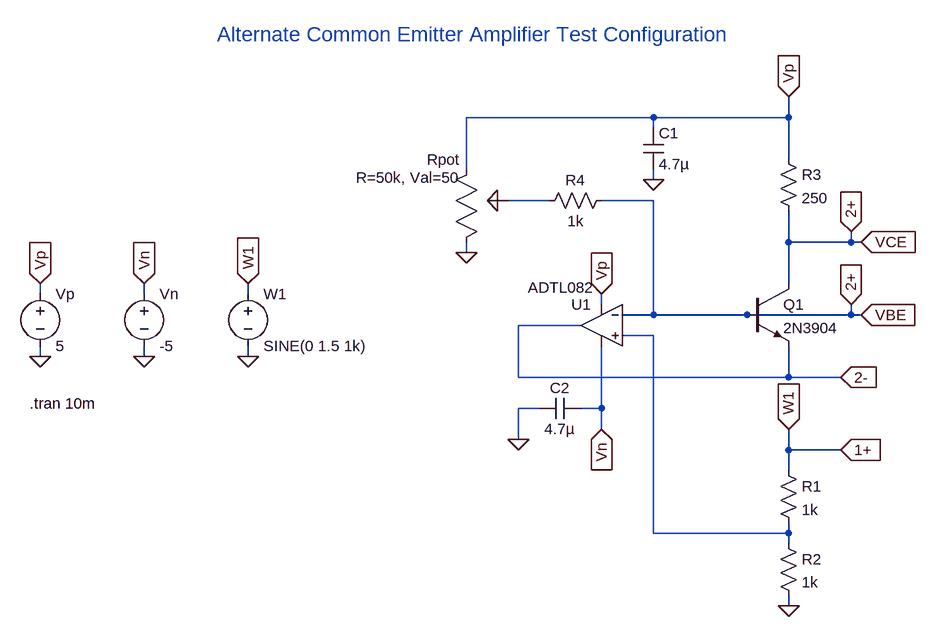
[diagram p0: schematic alt_ce_amp_test_config.asc]
alt_ce_amp_test_config.asc, the LTspice schematic file:
Version 4
SHEET 1 880 744
WIRE 240 -48 -48 -48
WIRE 448 -48 448 -80
WIRE 448 -48 240 -48
WIRE 240 -32 240 -48
WIRE 448 16 448 -48
WIRE -48 32 -48 -48
WIRE 240 48 240 32
WIRE 80 80 16 80
WIRE 240 80 160 80
WIRE 448 144 448 96
WIRE 544 144 544 128
WIRE 544 144 448 144
WIRE 560 144 544 144
WIRE -48 160 -48 144
WIRE 448 208 448 144
WIRE -704 224 -704 208
WIRE -544 224 -544 208
WIRE -384 224 -384 208
WIRE 160 240 160 224
WIRE 240 256 240 80
WIRE 240 256 192 256
WIRE 384 256 240 256
WIRE 544 256 544 240
WIRE 544 256 384 256
WIRE 560 256 544 256
WIRE 128 272 32 272
WIRE 240 288 192 288
WIRE -704 320 -704 304
WIRE -544 320 -544 304
WIRE -384 320 -384 304
WIRE 32 352 32 272
WIRE 448 352 448 304
WIRE 448 352 32 352
WIRE 528 352 448 352
WIRE 64 400 32 400
WIRE 160 400 160 304
WIRE 160 400 128 400
WIRE 160 432 160 400
WIRE 32 448 32 400
WIRE 448 464 448 432
WIRE 528 464 448 464
WIRE 448 496 448 464
WIRE 240 592 240 288
WIRE 448 592 448 576
WIRE 448 592 240 592
WIRE 448 608 448 592
WIRE 448 704 448 688
FLAG 160 224 Vp
IOPIN 160 224 In
FLAG 160 432 Vn
IOPIN 160 432 In
FLAG -48 160 0
FLAG 32 448 0
FLAG 448 704 0
FLAG 448 -80 Vp
IOPIN 448 -80 In
FLAG 240 48 0
FLAG 448 432 W1
IOPIN 448 432 In
FLAG 544 128 2+
IOPIN 544 128 In
FLAG 544 240 2+
IOPIN 544 240 In
FLAG 528 352 2-
IOPIN 528 352 In
FLAG 528 464 1+
IOPIN 528 464 In
FLAG 560 144 VCE
IOPIN 560 144 In
FLAG 560 256 VBE
IOPIN 560 256 In
FLAG -704 320 0
FLAG -544 320 0
FLAG -384 320 0
FLAG -704 208 Vp
IOPIN -704 208 In
FLAG -544 208 Vn
IOPIN -544 208 In
FLAG -384 208 W1
IOPIN -384 208 In
SYMBOL Opamps\\ADTL082 160 208 M0
WINDOW 3 11 6 Left 2
SYMATTR InstName U1
SYMBOL npn 384 208 R0
SYMATTR InstName Q1
SYMATTR Value 2N3904
SYMBOL res 432 480 R0
SYMATTR InstName R1
SYMATTR Value 1k
SYMBOL res 432 592 R0
SYMATTR InstName R2
SYMATTR Value 1k
SYMBOL res 432 0 R0
SYMATTR InstName R3
SYMATTR Value 250
SYMBOL res 176 64 R90
WINDOW 0 0 56 VBottom 2
WINDOW 3 32 56 VTop 2
SYMATTR InstName R4
SYMATTR Value 1k
SYMBOL cap 224 -32 R0
SYMATTR InstName C1
SYMATTR Value 4.7µ
SYMBOL potentiometer -32 48 M0
WINDOW 0 26 -31 Left 2
WINDOW 39 26 -3 Left 2
SYMATTR InstName Rpot
SYMBOL cap 128 384 R90
WINDOW 0 0 32 VBottom 2
WINDOW 3 32 32 VTop 2
SYMATTR InstName C2
SYMATTR Value 4.7µ
SYMBOL voltage -384 208 R0
WINDOW 123 0 0 Left 0
WINDOW 39 0 0 Left 0
SYMATTR InstName W1
SYMATTR Value SINE(0 1.5 1k)
SYMBOL voltage -544 208 R0
WINDOW 123 0 0 Left 0
WINDOW 39 0 0 Left 0
SYMATTR InstName Vn
SYMATTR Value -5
SYMBOL voltage -704 208 R0
WINDOW 123 0 0 Left 0
WINDOW 39 0 0 Left 0
SYMATTR InstName Vp
SYMATTR Value 5
TEXT -432 -176 Left 3 ;Alternate Common Emitter Amplifier Test Configuration
TEXT -720 392 Left 2 !.tran 10m

The netlist it stands for:
* alt_ce_amp_test_config.asc
XU1 N002 VBE Vp Vn 2- ADTL082  ; pins In+ In- V+ V- OUT
Q1 VBE VBE 2- 0 2N3904
R1 1+ N002 1k
R2 N002 0 1k
R3 Vp VBE 250
R4 VBE N001 1k
C1 Vp 0 4.7µ
XRpot Vp N001 0 potentiometer R=50k, Val=50  ; pins 1 2 3
C2 Vn 0 4.7µ
V§W1 1+ 0 SINE(0 1.5 1k)
Vn Vn 0 -5
Vp Vp 0 5
.model NPN NPN
.model PNP PNP
.lib standard.bjt
* Alternate Common Emitter Amplifier Test Configuration
.tran 10m
.lib ADI.lib
.backanno
.end